# Altium project GT-V1.PrjPcb
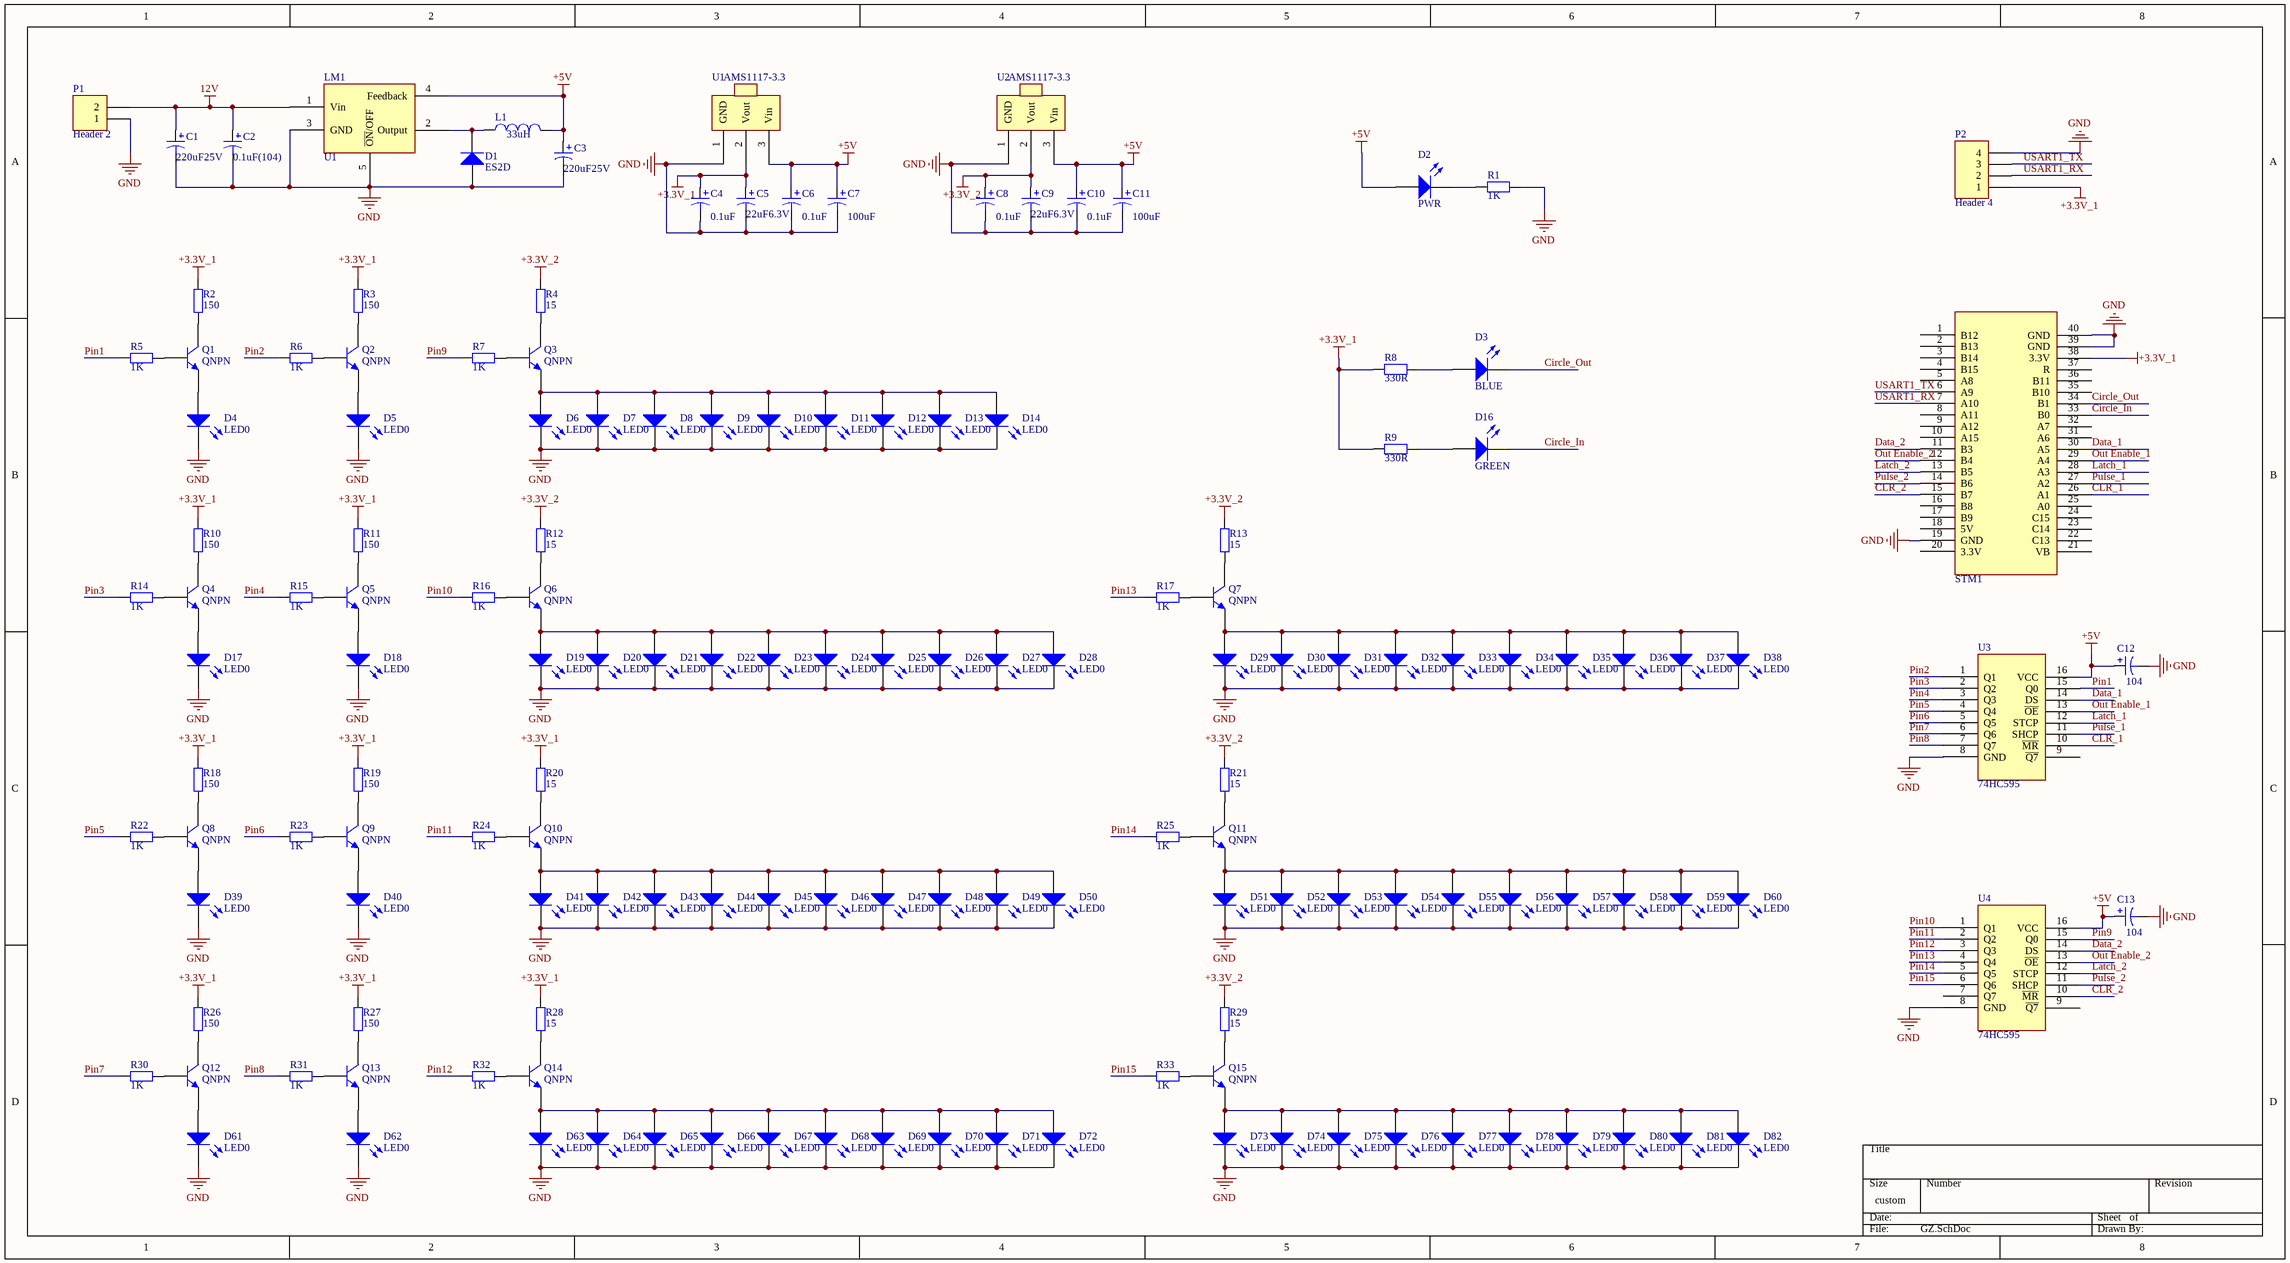
[diagram p0: GZ.SchDoc]
1 sheet, 151 parts. Net scope: global (net labels, ports and power ports of the same name join across sheets).
Board file: GZPCB_v4.PcbDoc

## Sheet GZ.SchDoc
size 508 x 279 mm

### Parts
C1  220uF25V  [3mmcap]
C2  0.1uF(104)  [C0805]
C3  220uF25V  [3mmcap]
C4  value 0.1uF  [C0805]  (hidden comment: 0.1uF(104))
C5  value 22uF6.3V  [C0805]  (hidden comment: 100uf(107))
C6  value 0.1uF  [C0805]  (hidden comment: 0.1uF(104))
C7  value 100uF  [C0805]  (hidden comment: 100uf(107))
C8  value 0.1uF  [C0805]  (hidden comment: 0.1uF(104))
C9  value 22uF6.3V  [C0805]  (hidden comment: 100uf(107))
C10  value 0.1uF  [C0805]  (hidden comment: 0.1uF(104))
C11  value 100uF  [C0805]  (hidden comment: 100uf(107))
C12  value 104  [C0805]  (hidden comment: 0.1uF(104))
C13  value 104  [C0805]  (hidden comment: 0.1uF(104))
D1  ES2D  [SMC]
D2  PWR  [3mm]
D3  BLUE  [3mm]
D4  LED0  [5mm]
D5  LED0  [5mm]
D6  LED0  [5mm]
D7  LED0  [5mm]
D8  LED0  [5mm]
D9  LED0  [5mm]
D10  LED0  [5mm]
D11  LED0  [5mm]
D12  LED0  [5mm]
D13  LED0  [5mm]
D14  LED0  [5mm]
D16  GREEN  [3mm]
D17  LED0  [5mm]
D18  LED0  [5mm]
D19  LED0  [3mm]
D20  LED0  [3mm]
D21  LED0  [3mm]
D22  LED0  [3mm]
D23  LED0  [3mm]
D24  LED0  [3mm]
D25  LED0  [3mm]
D26  LED0  [3mm]
D27  LED0  [3mm]
D28  LED0  [3mm]
D29  LED0  [3mm]
D30  LED0  [3mm]
D31  LED0  [3mm]
D32  LED0  [3mm]
D33  LED0  [3mm]
D34  LED0  [3mm]
D35  LED0  [3mm]
D36  LED0  [3mm]
D37  LED0  [3mm]
D38  LED0  [3mm]
D39  LED0  [3mm]
D40  LED0  [3mm]
D41  LED0  [3mm]
D42  LED0  [3mm]
D43  LED0  [3mm]
D44  LED0  [3mm]
D45  LED0  [3mm]
D46  LED0  [3mm]
D47  LED0  [3mm]
D48  LED0  [3mm]
D49  LED0  [3mm]
D50  LED0  [3mm]
D51  LED0  [3mm]
D52  LED0  [3mm]
D53  LED0  [3mm]
D54  LED0  [3mm]
D55  LED0  [3mm]
D56  LED0  [3mm]
D57  LED0  [3mm]
D58  LED0  [3mm]
D59  LED0  [3mm]
D60  LED0  [3mm]
D61  LED0  [3mm]
D62  LED0  [3mm]
D63  LED0  [3mm]
D64  LED0  [3mm]
D65  LED0  [3mm]
D66  LED0  [3mm]
D67  LED0  [3mm]
D68  LED0  [3mm]
D69  LED0  [3mm]
D70  LED0  [3mm]
D71  LED0  [3mm]
D72  LED0  [3mm]
D73  LED0  [3mm]
D74  LED0  [3mm]
D75  LED0  [3mm]
D76  LED0  [3mm]
D77  LED0  [3mm]
D78  LED0  [3mm]
D79  LED0  [3mm]
D80  LED0  [3mm]
D81  LED0  [3mm]
D82  LED0  [3mm]
L1  value 33uH  [7*7mm贴片电感]  (hidden comment: Inductor)
LM1  U1  [TO-263-5]
P1  Header 2  [HDR1X2]
P2  Header 4  [HDR1X4]
Q1  QNPN  [SOT-23B_N]
Q2  QNPN  [SOT-23B_N]
Q3  QNPN  [SOT-23B_N]
Q4  QNPN  [SOT-23B_N]
Q5  QNPN  [SOT-23B_N]
Q6  QNPN  [SOT-23B_N]
Q7  QNPN  [SOT-23B_N]
Q8  QNPN  [SOT-23B_N]
Q9  QNPN  [SOT-23B_N]
Q10  QNPN  [SOT-23B_N]
Q11  QNPN  [SOT-23B_N]
Q12  QNPN  [SOT-23B_N]
Q13  QNPN  [SOT-23B_N]
Q14  QNPN  [SOT-23B_N]
Q15  QNPN  [SOT-23B_N]
R1  value 1K  [6-0805_N]  (hidden comment: Res2)
R2  value 150  [6-0805_N]  (hidden comment: Res2)
R3  value 150  [6-0805_N]  (hidden comment: Res2)
R4  value 15  [6-0805_N]  (hidden comment: Res2)
R5  value 1K  [6-0805_N]  (hidden comment: Res2)
R6  value 1K  [6-0805_N]  (hidden comment: Res2)
R7  value 1K  [6-0805_N]  (hidden comment: Res2)
R8  value 330R  [6-0805_N]  (hidden comment: Res2)
R9  value 330R  [6-0805_N]  (hidden comment: Res2)
R10  value 150  [6-0805_N]  (hidden comment: Res2)
R11  value 150  [6-0805_N]  (hidden comment: Res2)
R12  value 15  [6-0805_N]  (hidden comment: Res2)
R13  value 15  [6-0805_N]  (hidden comment: Res2)
R14  value 1K  [6-0805_N]  (hidden comment: Res2)
R15  value 1K  [6-0805_N]  (hidden comment: Res2)
R16  value 1K  [6-0805_N]  (hidden comment: Res2)
R17  value 1K  [6-0805_N]  (hidden comment: Res2)
R18  value 150  [6-0805_N]  (hidden comment: Res2)
R19  value 150  [6-0805_N]  (hidden comment: Res2)
R20  value 15  [6-0805_N]  (hidden comment: Res2)
R21  value 15  [6-0805_N]  (hidden comment: Res2)
R22  value 1K  [6-0805_N]  (hidden comment: Res2)
R23  value 1K  [6-0805_N]  (hidden comment: Res2)
R24  value 1K  [6-0805_N]  (hidden comment: Res2)
R25  value 1K  [6-0805_N]  (hidden comment: Res2)
R26  value 150  [6-0805_N]  (hidden comment: Res2)
R27  value 150  [6-0805_N]  (hidden comment: Res2)
R28  value 15  [6-0805_N]  (hidden comment: Res2)
R29  value 15  [6-0805_N]  (hidden comment: Res2)
R30  value 1K  [6-0805_N]  (hidden comment: Res2)
R31  value 1K  [6-0805_N]  (hidden comment: Res2)
R32  value 1K  [6-0805_N]  (hidden comment: Res2)
R33  value 1K  [6-0805_N]  (hidden comment: Res2)
STM1  STM32F103C8核心板  [STM32F103C8T6]  (value not drawn)
U1  AMS1117-3.3  [SOT223_N]
U2  AMS1117-3.3  [SOT223_N]
U3  74HC595  [dip16]
U4  74HC595  [dip16]

### Nets
12V: C1.1 C2.1 LM1.1(Vin) P1.2
+3.3V_1: C4.1 C5.1 P2.1 R2.1 R3.1 R8.2 R9.2 R10.1 R11.1 R18.1 R19.1 R20.1 R26.1 R27.1 R28.1 STM1.38(3.3V) U1.2(Vout)
+3.3V_2: C8.1 C9.1 R4.1 R12.1 R13.1 R21.1 R29.1 U2.2(Vout)
+5V: C3.1 C6.1 C7.1 C10.1 C11.1 C12.1 C13.1 D2.1(A) L1.2 LM1.4(Feedback) U1.3(Vin) U2.3(Vin) U3.16(VCC) U4.16(VCC)
GND: C1.2 C2.2 C3.2 C4.2 C5.2 C6.2 C7.2 C8.2 C9.2 C10.2 C11.2 C12.2 C13.2 D1.1(A) D4.2(K) D5.2(K) D6.2(K) D7.2(K) D8.2(K) D9.2(K) D10.2(K) D11.2(K) D12.2(K) D13.2(K) D14.2(K) D17.2(K) D18.2(K) D19.2(K) D20.2(K) D21.2(K) D22.2(K) D23.2(K) D24.2(K) D25.2(K) D26.2(K) D27.2(K) D28.2(K) D29.2(K) D30.2(K) D31.2(K) D32.2(K) D33.2(K) D34.2(K) D35.2(K) D36.2(K) D37.2(K) D38.2(K) D39.2(K) D40.2(K) D41.2(K) D42.2(K) D43.2(K) D44.2(K) D45.2(K) D46.2(K) D47.2(K) D48.2(K) D49.2(K) D50.2(K) D51.2(K) D52.2(K) D53.2(K) D54.2(K) D55.2(K) D56.2(K) D57.2(K) D58.2(K) D59.2(K) D60.2(K) D61.2(K) D62.2(K) D63.2(K) D64.2(K) D65.2(K) D66.2(K) D67.2(K) D68.2(K) D69.2(K) D70.2(K) D71.2(K) D72.2(K) D73.2(K) D74.2(K) D75.2(K) D76.2(K) D77.2(K) D78.2(K) D79.2(K) D80.2(K) D81.2(K) D82.2(K) LM1.3(GND) LM1.5(~{ON}/OFF) P1.1 P2.4 R1.1 STM1.19(GND) STM1.39(GND) STM1.40(GND) U1.1(GND) U2.1(GND) U3.8(GND) U4.8(GND)
Circle_In: D16.2(K) STM1.33(B0)
Circle_Out: D3.2(K) STM1.34(B1)
CLR_1: STM1.26(A1) U3.10(~{MR})
CLR_2: STM1.15(B7) U4.10(~{MR})
Data_1: STM1.30(A5) U3.14(DS)
Data_2: STM1.11(B3) U4.14(DS)
Latch_1: STM1.28(A3) U3.12(STCP)
Latch_2: STM1.13(B5) U4.12(STCP)
Out Enable_1: STM1.29(A4) U3.13(~{OE})
Out Enable_2: STM1.12(B4) U4.13(~{OE})
Pin1: R5.2 U3.15(Q0)
Pin2: R6.2 U3.1(Q1)
Pin3: R14.2 U3.2(Q2)
Pin4: R15.2 U3.3(Q3)
Pin5: R22.2 U3.4(Q4)
Pin6: R23.2 U3.5(Q5)
Pin7: R30.2 U3.6(Q6)
Pin8: R31.2 U3.7(Q7)
Pin9: R7.2 U4.15(Q0)
Pin10: R16.2 U4.1(Q1)
Pin11: R24.2 U4.2(Q2)
Pin12: R32.2 U4.3(Q3)
Pin13: R17.2 U4.4(Q4)
Pin14: R25.2 U4.5(Q5)
Pin15: R33.2 U4.6(Q6)
Pulse_1: STM1.27(A2) U3.11(SHCP)
Pulse_2: STM1.14(B6) U4.11(SHCP)
USART1_RX: P2.2 STM1.7(A10)
USART1_TX: P2.3 STM1.6(A9)
NetD1_2: D1.2(K) L1.1 LM1.2(Output)
NetD2_2: D2.2(K) R1.2
NetD3_1: D3.1(A) R8.1
NetD4_1: D4.1(A) Q1.2(E)
NetD5_1: D5.1(A) Q2.2(E)
NetD6_1: D6.1(A) D7.1(A) D8.1(A) D9.1(A) D10.1(A) D11.1(A) D12.1(A) D13.1(A) D14.1(A) Q3.2(E)
NetD16_1: D16.1(A) R9.1
NetD17_1: D17.1(A) Q4.2(E)
NetD18_1: D18.1(A) Q5.2(E)
NetD19_1: D19.1(A) D20.1(A) D21.1(A) D22.1(A) D23.1(A) D24.1(A) D25.1(A) D26.1(A) D27.1(A) D28.1(A) Q6.2(E)
NetD29_1: D29.1(A) D30.1(A) D31.1(A) D32.1(A) D33.1(A) D34.1(A) D35.1(A) D36.1(A) D37.1(A) D38.1(A) Q7.2(E)
NetD39_1: D39.1(A) Q8.2(E)
NetD40_1: D40.1(A) Q9.2(E)
NetD41_1: D41.1(A) D42.1(A) D43.1(A) D44.1(A) D45.1(A) D46.1(A) D47.1(A) D48.1(A) D49.1(A) D50.1(A) Q10.2(E)
NetD51_1: D51.1(A) D52.1(A) D53.1(A) D54.1(A) D55.1(A) D56.1(A) D57.1(A) D58.1(A) D59.1(A) D60.1(A) Q11.2(E)
NetD61_1: D61.1(A) Q12.2(E)
NetD62_1: D62.1(A) Q13.2(E)
NetD63_1: D63.1(A) D64.1(A) D65.1(A) D66.1(A) D67.1(A) D68.1(A) D69.1(A) D70.1(A) D71.1(A) D72.1(A) Q14.2(E)
NetD73_1: D73.1(A) D74.1(A) D75.1(A) D76.1(A) D77.1(A) D78.1(A) D79.1(A) D80.1(A) D81.1(A) D82.1(A) Q15.2(E)
NetQ1_1: Q1.1(B) R5.1
NetQ1_3: Q1.3(C) R2.2
NetQ2_1: Q2.1(B) R6.1
NetQ2_3: Q2.3(C) R3.2
NetQ3_1: Q3.1(B) R7.1
NetQ3_3: Q3.3(C) R4.2
NetQ4_1: Q4.1(B) R14.1
NetQ4_3: Q4.3(C) R10.2
NetQ5_1: Q5.1(B) R15.1
NetQ5_3: Q5.3(C) R11.2
NetQ6_1: Q6.1(B) R16.1
NetQ6_3: Q6.3(C) R12.2
NetQ7_1: Q7.1(B) R17.1
NetQ7_3: Q7.3(C) R13.2
NetQ8_1: Q8.1(B) R22.1
NetQ8_3: Q8.3(C) R18.2
NetQ9_1: Q9.1(B) R23.1
NetQ9_3: Q9.3(C) R19.2
NetQ10_1: Q10.1(B) R24.1
NetQ10_3: Q10.3(C) R20.2
NetQ11_1: Q11.1(B) R25.1
NetQ11_3: Q11.3(C) R21.2
NetQ12_1: Q12.1(B) R30.1
NetQ12_3: Q12.3(C) R26.2
NetQ13_1: Q13.1(B) R31.1
NetQ13_3: Q13.3(C) R27.2
NetQ14_1: Q14.1(B) R32.1
NetQ14_3: Q14.3(C) R28.2
NetQ15_1: Q15.1(B) R33.1
NetQ15_3: Q15.3(C) R29.2

Not connected (* = marked no-connect by the designer): STM1 1(B12) 2(B13) 3(B14) 4(B15) 5(A8) 8(A11) 9(A12) 10(A15) 16(B8) 17(B9) 18(5V) 20(3.3V) 21(VB) 22(C13) 23(C14) 24(C15) 25(A0) 31(A6) 32(A7) 35(B10) 36(B11) 37(R); U1 4(gnd); U2 4(gnd); U3 9(~{Q7}); U4 7(Q7) 9(~{Q7})

### Library data of the parts
C1 C3 = Cap Pol1: 直插铝电解电容; Published: 8-Jun-2000; LatestRevisionDate: 17-Jul-2002; LatestRevisionNote: Re-released for DXP Platform.; PackageReference: RB7.6-15; Publisher: Altium Limited; PackageDescription: Polarized Capacitor (Radial); 2 Leads; Value: 220uF25V
C2 C4-C13 = Cap Pol3: Polarized Capacitor (Surface Mount); Published: 8-Jun-2000; LatestRevisionDate: 29-May-2009; LatestRevisionNote: IPC-7351 Footprint Added.; PackageReference: C0805; Publisher: Altium Limited; PackageDescription: Chip Capacitor
  C2: Value: 0.1uF(104)
D1 = Diode: Published: 8-Jun-2000; LatestRevisionDate: 17-Jul-2002; LatestRevisionNote: Re-released for DXP Platform.; PackageVersion: Sep-1996; PackageReference: SMC; Publisher: Altium Limited; PackageDescription: DO-214-AB/SMC; 2 C-Bend Leads; Body 7.9 x 5.9 mm, inc. leads (LxW); Code_JEDEC: DO-214-AB
D2 = LED0: RED-LED; Published: 8-Jun-2000; LatestRevisionDate: 08-Jul-2005; LatestRevisionNote: Mech Layer 1 removed.; PackageReference: LED-0; Publisher: Altium Limited; PackageDescription: LED; 2 Leads
D3 = LED0: BLUE-LED; Published: 8-Jun-2000; LatestRevisionDate: 08-Jul-2005; LatestRevisionNote: Mech Layer 1 removed.; PackageReference: LED-0; Publisher: Altium Limited; PackageDescription: LED; 2 Leads
D4-D14 D17 D18 = LED0: 850nm IR-LED; Published: 8-Jun-2000; LatestRevisionDate: 08-Jul-2005; LatestRevisionNote: Mech Layer 1 removed.; PackageReference: LED-0; Publisher: Altium Limited; PackageDescription: LED; 2 Leads
D16 = LED0: GREEN-LED; Published: 8-Jun-2000; LatestRevisionDate: 08-Jul-2005; LatestRevisionNote: Mech Layer 1 removed.; PackageReference: LED-0; Publisher: Altium Limited; PackageDescription: LED; 2 Leads
D19-D82 = LED0: 940nm IR-LED; Published: 8-Jun-2000; LatestRevisionDate: 08-Jul-2005; LatestRevisionNote: Mech Layer 1 removed.; PackageReference: LED-0; Publisher: Altium Limited; PackageDescription: LED; 2 Leads
L1 = Inductor: 33uH; Code_IEC: 1005; Published: 8-Jun-2000; LatestRevisionDate: 29-May-2009; LatestRevisionNote: IPC-7351 Footprint Added.; PackageReference: 0402-A; Publisher: Altium Limited; PackageDescription: Chip Inductor; Code_JEITA: 0402
LM1 = LM2596: LM2596-5.0
P1 = Header 2: 电源接口; LatestRevisionDate: 17-Jul-2002; LatestRevisionNote: Re-released for DXP Platform.; Publisher: Altium Limited
P2 = Header 4: 串口接口; LatestRevisionDate: 17-Jul-2002; LatestRevisionNote: Re-released for DXP Platform.; Publisher: Altium Limited
Q1-Q15 = QNPN: NPN Bipolar Transistor; Published: 8-Jun-2000; LatestRevisionDate: 29-May-2009; LatestRevisionNote: IPC-7351 Footprint Added.; PackageVersion: Aug-1999; PackageReference: SOT-23B; Publisher: Altium Limited; PackageDescription: 3-Pin SOT-23 Package 0.95 mm Pitch, 2.4 mm Lead Span
R1-R33 = Res2: Resistor; Published: 8-Jun-2000; LatestRevisionDate: 17-Jul-2002; LatestRevisionNote: Re-released for DXP Platform.; PackageReference: AXIAL-0.4; Publisher: Altium Limited; PackageDescription: Axial Device, Thru-Hole; 2 Leads; 0.4 in Pin Spacing